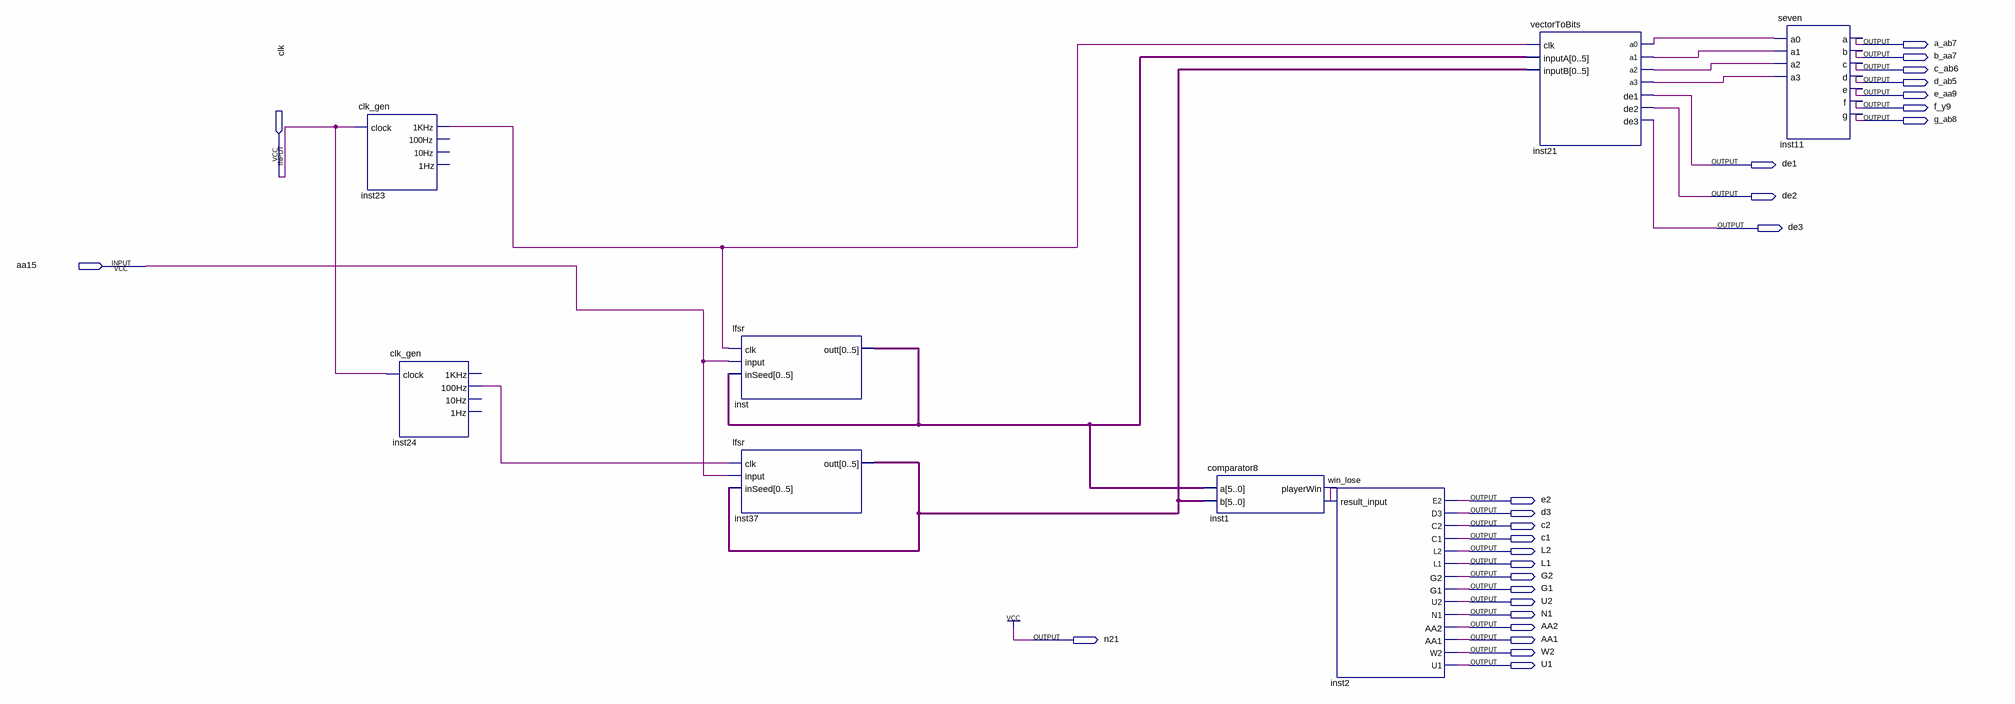
[diagram p0: schematic sheet]
// Quartus schematic final.bdf as structural Verilog: 8 symbols, 27 pins
module \final  (
  input  clk,
  input  aa15,
  output a_ab7,
  output b_aa7,
  output c_ab6,
  output d_ab5,
  output e_aa9,
  output f_y9,
  output g_ab8,
  output de1,
  output de2,
  output de3,
  output e2,
  output d3,
  output c2,
  output c1,
  output L2,
  output L1,
  output G2,
  output G1,
  output U2,
  output N1,
  output AA2,
  output n21,
  output AA1,
  output W2,
  output U1
);

  wire inst1_playerwin, inst21_a0, inst21_a1, inst21_a2, inst21_a3, inst23_1khz, inst24_100hz;
  wire [5:0] inst37_outt, inst_outt;

  clk_gen inst23 (.clock(clk), .\1KHz (inst23_1khz));  // open: 100Hz, 10Hz, 1Hz
  clk_gen inst24 (.clock(clk), .\100Hz (inst24_100hz));  // open: 1KHz, 10Hz, 1Hz
  lfsr inst (.clk(inst23_1khz), .\input (aa15), .inSeed(inst_outt), .outt(inst_outt));
  lfsr inst37 (.clk(inst24_100hz), .\input (aa15), .inSeed(inst37_outt), .outt(inst37_outt));
  comparator8 inst1 (.a(inst_outt), .b(inst37_outt), .playerWin(inst1_playerwin));
  win_lose inst2 (
    .result_input(inst1_playerwin), .E2(e2), .D3(d3), .C2(c2), .C1(c1), .L2(L2), .L1(L1), .G2(G2), .G1(G1),
    .U2(U2), .N1(N1), .AA2(AA2), .AA1(AA1), .W2(W2), .U1(U1));
  vectorToBits inst21 (
    .clk(inst23_1khz), .inputA(inst_outt), .inputB(inst37_outt), .a0(inst21_a0), .a1(inst21_a1),
    .a2(inst21_a2), .a3(inst21_a3), .de1(de1), .de2(de2), .de3(de3));
  seven inst11 (
    .a0(inst21_a0), .a1(inst21_a1), .a2(inst21_a2), .a3(inst21_a3), .a(a_ab7), .b(b_aa7), .c(c_ab6),
    .d(d_ab5), .e(e_aa9), .f(f_y9), .g(g_ab8));

  assign n21 = 1'b1;
endmodule
